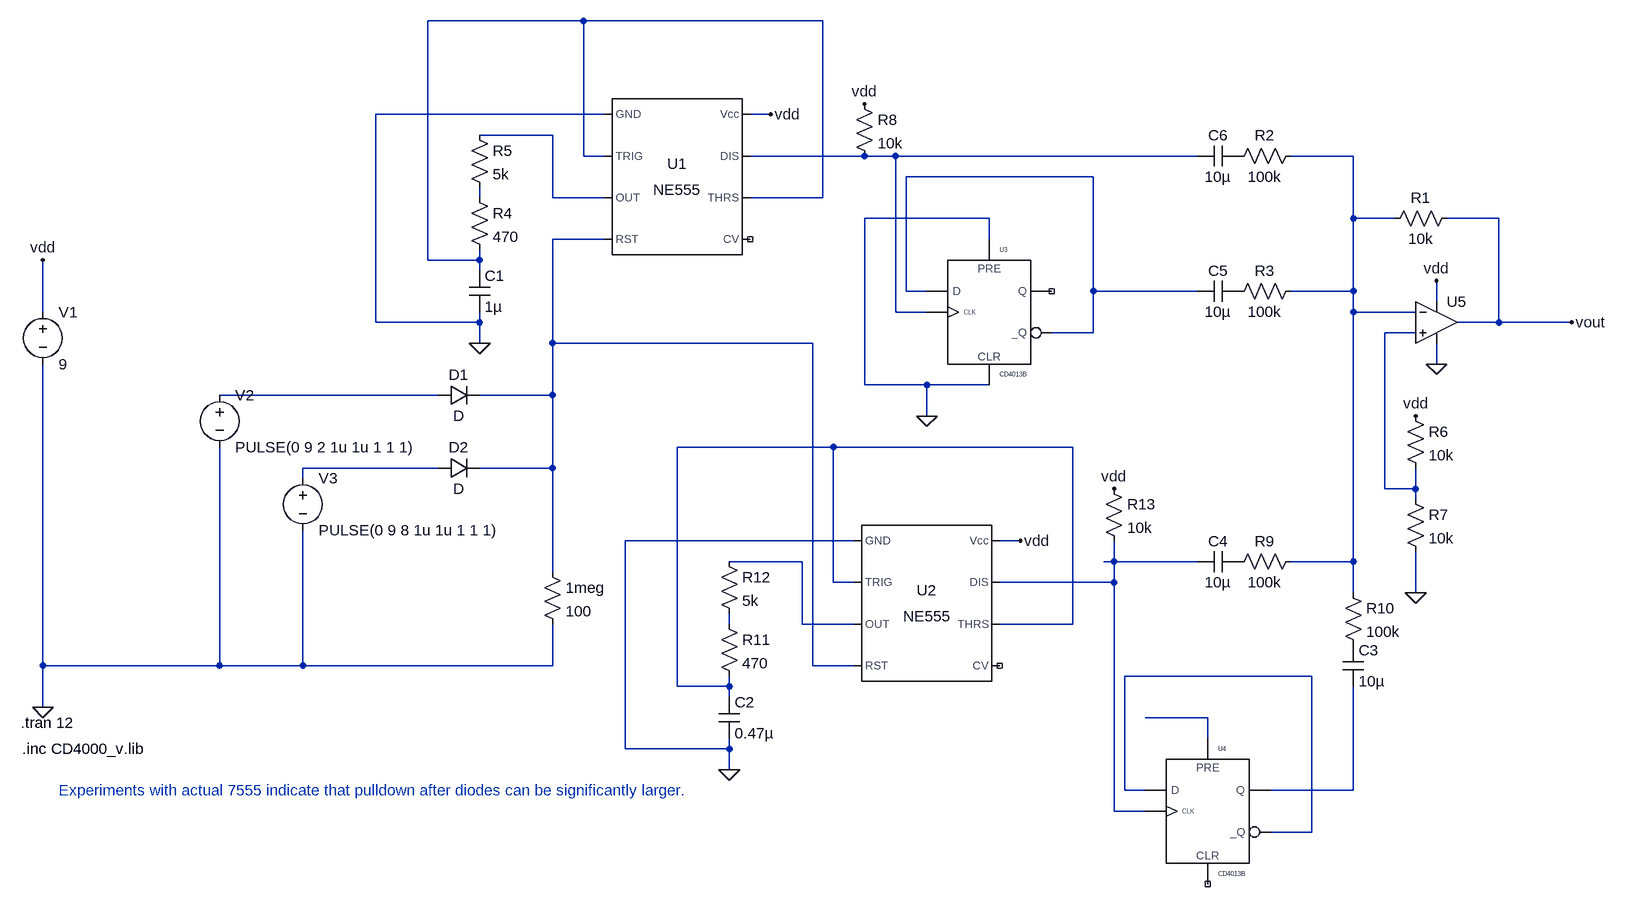
[diagram p0: schematic oscillators.asc]
oscillators.asc, the LTspice schematic file:
Version 4
SHEET 1 1896 1140
WIRE 16 -352 -224 -352
WIRE 384 -352 16 -352
WIRE 48 -208 -304 -208
WIRE 304 -208 272 -208
WIRE -32 -176 -144 -176
WIRE 16 -144 16 -352
WIRE 48 -144 16 -144
WIRE 448 -144 272 -144
WIRE 496 -144 448 -144
WIRE 960 -144 496 -144
WIRE 1200 -144 1104 -144
WIRE 800 -112 512 -112
WIRE -144 -80 -144 -96
WIRE -32 -80 -32 -176
WIRE 48 -80 -32 -80
WIRE 384 -80 384 -352
WIRE 384 -80 272 -80
WIRE 640 -48 448 -48
WIRE 1200 -48 1200 -144
WIRE 1264 -48 1200 -48
WIRE 1424 -48 1344 -48
WIRE 48 -16 -32 -16
WIRE 640 -16 640 -48
WIRE -224 16 -224 -352
WIRE -144 16 -144 0
WIRE -144 16 -224 16
WIRE -144 32 -144 16
WIRE 512 64 512 -112
WIRE 544 64 512 64
WIRE 800 64 800 -112
WIRE 960 64 800 64
WIRE 1200 64 1200 -48
WIRE 1200 64 1104 64
WIRE 1328 80 1328 48
WIRE -816 96 -816 16
WIRE 496 96 496 -144
WIRE 544 96 496 96
WIRE 1200 96 1200 64
WIRE 1296 96 1200 96
WIRE -304 112 -304 -208
WIRE -144 112 -144 96
WIRE -144 112 -304 112
WIRE 1424 112 1424 -48
WIRE 1424 112 1360 112
WIRE 1536 112 1424 112
WIRE 800 128 800 64
WIRE 800 128 736 128
WIRE 1296 128 1248 128
WIRE -144 144 -144 112
WIRE -32 144 -32 -16
WIRE 368 144 -32 144
WIRE 1328 176 1328 144
WIRE 448 208 448 -48
WIRE 544 208 448 208
WIRE 640 208 544 208
WIRE -208 224 -544 224
WIRE -32 224 -32 144
WIRE -32 224 -144 224
WIRE 544 256 544 208
WIRE 400 304 160 304
WIRE 768 304 400 304
WIRE -208 336 -416 336
WIRE -32 336 -32 224
WIRE -32 336 -144 336
WIRE -416 352 -416 336
WIRE 1248 368 1248 128
WIRE 1296 368 1296 336
WIRE 1296 368 1248 368
WIRE 1296 384 1296 368
WIRE 432 448 80 448
WIRE 688 448 656 448
WIRE 352 480 240 480
WIRE 832 480 832 448
WIRE 832 480 816 480
WIRE 960 480 832 480
WIRE 1200 480 1200 96
WIRE 1200 480 1104 480
WIRE -32 496 -32 336
WIRE 400 512 400 304
WIRE 432 512 400 512
WIRE 832 512 832 480
WIRE 832 512 656 512
WIRE 1200 528 1200 480
WIRE 1296 528 1296 464
WIRE 240 576 240 560
WIRE 352 576 352 480
WIRE 432 576 352 576
WIRE 768 576 768 304
WIRE 768 576 656 576
WIRE -816 640 -816 176
WIRE -544 640 -544 304
WIRE -544 640 -816 640
WIRE -416 640 -416 432
WIRE -416 640 -544 640
WIRE -32 640 -32 576
WIRE -32 640 -416 640
WIRE 368 640 368 144
WIRE 432 640 368 640
WIRE 1136 656 848 656
WIRE 160 672 160 304
WIRE 240 672 240 656
WIRE 240 672 160 672
WIRE 240 688 240 672
WIRE -816 704 -816 640
WIRE 976 720 880 720
WIRE 976 752 976 720
WIRE 80 768 80 448
WIRE 240 768 240 752
WIRE 240 768 80 768
WIRE 240 800 240 768
WIRE 848 832 848 656
WIRE 880 832 848 832
WIRE 1200 832 1200 672
WIRE 1200 832 1072 832
WIRE 832 864 832 512
WIRE 880 864 832 864
WIRE 1136 896 1136 656
WIRE 1136 896 1072 896
FLAG -816 16 vdd
FLAG -816 704 0
FLAG -144 144 0
FLAG 544 256 0
FLAG 1296 256 vdd
FLAG 1296 528 0
FLAG 304 -208 vdd
FLAG 1328 176 0
FLAG 1328 48 vdd
FLAG 448 -224 vdd
FLAG 240 800 0
FLAG 688 448 vdd
FLAG 832 368 vdd
FLAG 1536 112 vout
SYMBOL voltage -816 80 R0
WINDOW 123 0 0 Left 2
WINDOW 39 0 0 Left 2
SYMATTR InstName V1
SYMATTR Value 9
SYMBOL Misc\\NE555 160 -112 R0
SYMATTR InstName U1
SYMBOL CD4013B 640 -16 R0
SYMATTR InstName U3
SYMBOL Opamps\\UniversalOpamp2 1328 112 R0
SYMATTR InstName U5
SYMBOL voltage -544 208 R0
WINDOW 123 0 0 Left 2
WINDOW 39 0 0 Left 2
SYMATTR InstName V2
SYMATTR Value PULSE(0 9 2 1u 1u 1 1 1)
SYMBOL voltage -416 336 R0
WINDOW 123 0 0 Left 2
WINDOW 39 0 0 Left 2
SYMATTR InstName V3
SYMATTR Value PULSE(0 9 8 1u 1u 1 1 1)
SYMBOL diode -208 240 R270
WINDOW 0 32 32 VTop 2
WINDOW 3 0 32 VBottom 2
SYMATTR InstName D1
SYMBOL diode -208 352 R270
WINDOW 0 32 32 VTop 2
WINDOW 3 0 32 VBottom 2
SYMATTR InstName D2
SYMBOL res -48 480 R0
SYMATTR InstName 1meg
SYMATTR Value 100
SYMBOL cap -160 32 R0
SYMATTR InstName C1
SYMATTR Value 1µ
SYMBOL res 1360 -64 R90
WINDOW 0 0 56 VBottom 2
WINDOW 3 32 56 VTop 2
SYMATTR InstName R1
SYMATTR Value 10k
SYMBOL res 1120 -160 R90
WINDOW 0 0 56 VBottom 2
WINDOW 3 32 56 VTop 2
SYMATTR InstName R2
SYMATTR Value 100k
SYMBOL res 1120 48 R90
WINDOW 0 0 56 VBottom 2
WINDOW 3 32 56 VTop 2
SYMATTR InstName R3
SYMATTR Value 100k
SYMBOL res -160 -96 R0
SYMATTR InstName R4
SYMATTR Value 470
SYMBOL res -160 -192 R0
SYMATTR InstName R5
SYMATTR Value 5k
SYMBOL res 1280 240 R0
SYMATTR InstName R6
SYMATTR Value 10k
SYMBOL res 1280 368 R0
SYMATTR InstName R7
SYMATTR Value 10k
SYMBOL res 432 -240 R0
SYMATTR InstName R8
SYMATTR Value 10k
SYMBOL Misc\\NE555 544 544 R0
SYMATTR InstName U2
SYMBOL cap 224 688 R0
SYMATTR InstName C2
SYMATTR Value 0.47µ
SYMBOL res 1120 464 R90
WINDOW 0 0 56 VBottom 2
WINDOW 3 32 56 VTop 2
SYMATTR InstName R9
SYMATTR Value 100k
SYMBOL res 1184 512 R0
SYMATTR InstName R10
SYMATTR Value 100k
SYMBOL res 224 560 R0
SYMATTR InstName R11
SYMATTR Value 470
SYMBOL res 224 464 R0
SYMATTR InstName R12
SYMATTR Value 5k
SYMBOL res 816 352 R0
SYMATTR InstName R13
SYMATTR Value 10k
SYMBOL CD4013B 976 752 R0
SYMATTR InstName U4
SYMBOL cap 1184 608 R0
SYMATTR InstName C3
SYMATTR Value 10µ
SYMBOL cap 1024 464 R90
WINDOW 0 0 32 VBottom 2
WINDOW 3 32 32 VTop 2
SYMATTR InstName C4
SYMATTR Value 10µ
SYMBOL cap 1024 48 R90
WINDOW 0 0 32 VBottom 2
WINDOW 3 32 32 VTop 2
SYMATTR InstName C5
SYMATTR Value 10µ
SYMBOL cap 1024 -160 R90
WINDOW 0 0 32 VBottom 2
WINDOW 3 32 32 VTop 2
SYMATTR InstName C6
SYMATTR Value 10µ
TEXT -850 728 Left 2 !.tran 12
TEXT -848 768 Left 2 !.inc CD4000_v.lib
TEXT -792 832 Left 2 ;Experiments with actual 7555 indicate that pulldown after diodes can be significantly larger.

The netlist it stands for:
* oscillators.asc
V1 vdd 0 9
XU1 0 N001 N002 N007 NC_01 N001 N003 vdd NE555  ; pins GND TRIG OUT RST CV THRS DIS Vcc
XU3 0 N003 N005 0 NC_02 N005 VDD 0 CD4013B VDD=5  SPEED=1.0  TRIPDT=5e-9  ; pins PRE CP D CLR Q _Q
XU5 N008 N004 vdd 0 vout level.2 Avol=1Meg GBW=10Meg Slew=10Meg ilimit=25m rail=0 Vos=0 phimargin=45 en=0 enk=0 in=0 ink=0 Rin=500Meg  ; pins IN+ IN- V+ V- OUT
V2 N009 0 PULSE(0 9 2 1u 1u 1 1 1)
V3 N011 0 PULSE(0 9 8 1u 1u 1 1 1)
D1 N009 N007 D
D2 N011 N007 D
R§1meg N007 0 100
C1 N001 0 1µ
R1 vout N004 10k
R2 N004 P001 100k
R3 N004 P002 100k
R4 N006 N001 470
R5 N002 N006 5k
R6 vdd N008 10k
R7 N008 0 10k
R8 vdd N003 10k
XU2 0 N010 N012 N007 NC_03 N010 N013 vdd NE555  ; pins GND TRIG OUT RST CV THRS DIS Vcc
C2 N010 0 0.47µ
R9 N004 P003 100k
R10 N004 P004 100k
R11 N014 N010 470
R12 N012 N014 5k
R13 vdd N013 10k
XU4 N016 N013 N015 NC_04 N017 N015 VDD 0 CD4013B VDD=5  SPEED=1.0  TRIPDT=5e-9  ; pins PRE CP D CLR Q _Q
C3 P004 N017 10µ
C4 P003 N013 10µ
C5 P002 N005 10µ
C6 P001 N003 10µ
.model D D
.lib standard.dio
.tran 12
.inc CD4000_v.lib
* Experiments with actual 7555 indicate that pulldown after diodes can be significantly larger.
.lib NE555.sub
.lib UniversalOpamps2.sub
.backanno
.end